# Altium project DigitalLabBoard.PrjPCB
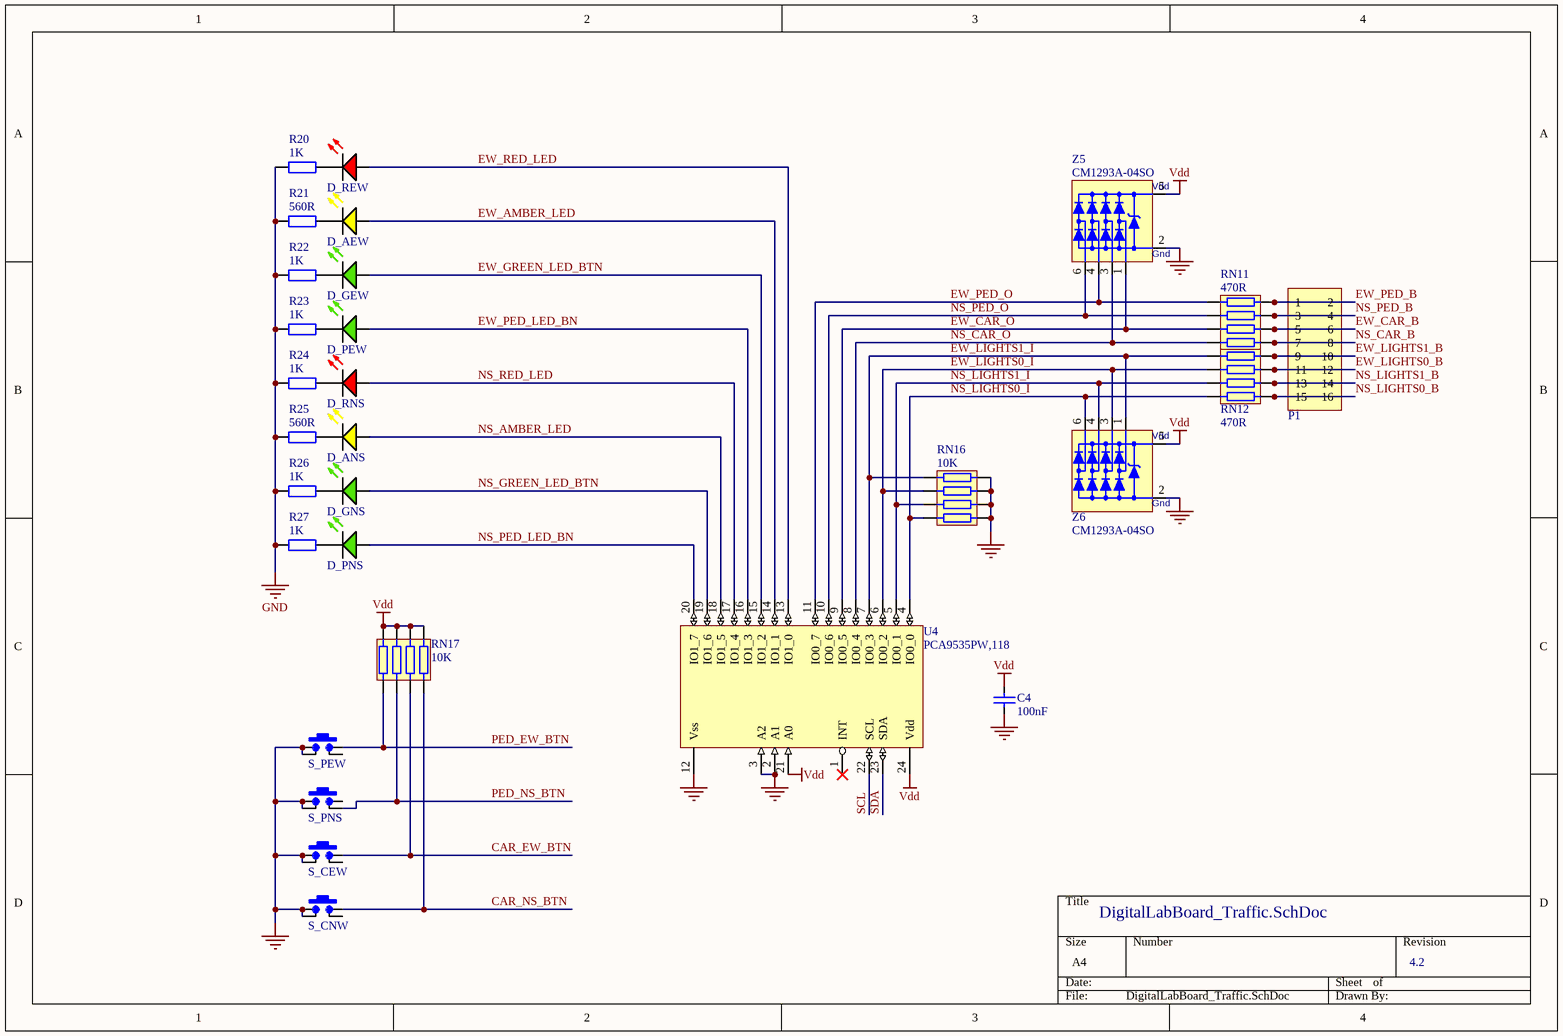
[diagram p0: DigitalLabBoard_Traffic.SchDoc]
Version: 4.2
6 sheets, 189 parts. Net scope: global (net labels, ports and power ports of the same name join across sheets).
Board files: DigitalLabBoard.PcbDoc, DigitalLabBoard_Jig.PcbDoc
Sheets:
  DigitalLabBoard_Traffic.SchDoc
  DigitalLabBoard_Processor.SchDoc
  DigitalLabBoard_Switches.SchDoc
  DigitalLabBoard_LEDs.SchDoc
  DigitalLabBoard_Die.SchDoc
  DigitalLabBoard_Stepper.SchDoc

## Sheet DigitalLabBoard_Traffic.SchDoc
size A4

### Parts
C4  100nF  [CCNP1608-0603]
D_AEW  LED Yellow  [LED1608-0603-Yellow]  (value not drawn)
D_ANS  LED Yellow  [LED1608-0603-Yellow]  (value not drawn)
D_GEW  LED Green  [LED1608-0603-GREEN]  (value not drawn)
D_GNS  LED Green  [LED1608-0603-GREEN]  (value not drawn)
D_PEW  LED Green  [LED1608-0603-GREEN]  (value not drawn)
D_PNS  LED Green  [LED1608-0603-GREEN]  (value not drawn)
D_REW  LED Red  [LED1608-0603-RED]  (value not drawn)
D_RNS  LED Red  [LED1608-0603-RED]  (value not drawn)
P1  Header 2x8  [HDR2X8S]  (value not drawn)
R20  1K  [CR1608-0603]
R21  560R  [CR1608-0603]
R22  1K  [CR1608-0603]
R23  1K  [CR1608-0603]
R24  1K  [CR1608-0603]
R25  560R  [CR1608-0603]
R26  1K  [CR1608-0603]
R27  1K  [CR1608-0603]
RN11  470R  [CR1206-0603_X4_N]
RN12  470R  [CR1206-0603_X4_N]
RN16  10K  [CR1206-0603_X4_N]
RN17  10K  [CR1206-0603_X4_N]
S_CEW  SMD-SW-4_5.1x5.1x2.0_M  [SMD-SW-4_5.1x5.1x2.0_M]  (value not drawn)
S_CNW  SMD-SW-4_5.1x5.1x2.0_M  [SMD-SW-4_5.1x5.1x2.0_M]  (value not drawn)
S_PEW  SMD-SW-4_5.1x5.1x2.0_M  [SMD-SW-4_5.1x5.1x2.0_M]  (value not drawn)
S_PNS  SMD-SW-4_5.1x5.1x2.0_M  [SMD-SW-4_5.1x5.1x2.0_M]  (value not drawn)
U4  PCA9535PW,118  [TSSOP24_N]
Z5  CM1293A-04SO  [SOT457_N]
Z6  CM1293A-04SO  [SOT457_N]

### Nets
GND: C4.1 R20.1 R21.1 R22.1 R23.1 R24.1 R25.1 R26.1 R27.1 RN16.5 RN16.6 RN16.7 RN16.8 S_CEW.1 S_CEW.1b S_CNW.1 S_CNW.1b S_PEW.2 S_PEW.2b S_PNS.1 S_PNS.1b U4.2(A1) U4.3(A2) U4.12(Vss) Z5.2(Vn) Z6.2(Vn)
Vdd: C4.2 RN17.1 RN17.2 RN17.3 RN17.4 U4.21(A0) U4.24(Vdd) Z5.5(Vp) Z6.5(Vp)  [project net Vcc]
CAR_EW_BTN: RN17.6 S_CEW.2b
CAR_NS_BTN: RN17.5 S_CNW.2b
EW_AMBER_LED: D_AEW.A U4.14(IO1_1)
EW_CAR_B: P1.5 P1.6 RN11.7
EW_CAR_O: RN11.2 U4.9(IO0_5) Z5.1
EW_GREEN_LED_BTN: D_GEW.A U4.15(IO1_2)
EW_LIGHTS0_B: P1.11 P1.12 RN12.6
EW_LIGHTS0_I: RN12.3 RN16.3 U4.6(IO0_2) Z6.3
EW_LIGHTS1_B: P1.9 P1.10 RN12.5
EW_LIGHTS1_I: RN12.4 RN16.4 U4.7(IO0_3) Z6.1
EW_PED_B: P1.1 P1.2 RN11.5
EW_PED_LED_BN: D_PEW.A U4.16(IO1_3)
EW_PED_O: RN11.4 U4.11(IO0_7) Z5.4
EW_RED_LED: D_REW.A U4.13(IO1_0)
NS_AMBER_LED: D_ANS.A U4.18(IO1_5)
NS_CAR_B: P1.7 P1.8 RN11.8
NS_CAR_O: RN11.1 U4.8(IO0_4) Z5.3
NS_GREEN_LED_BTN: D_GNS.A U4.19(IO1_6)
NS_LIGHTS0_B: P1.15 P1.16 RN12.8
NS_LIGHTS0_I: RN12.1 RN16.1 U4.4(IO0_0) Z6.6
NS_LIGHTS1_B: P1.13 P1.14 RN12.7
NS_LIGHTS1_I: RN12.2 RN16.2 U4.5(IO0_1) Z6.4
NS_PED_B: P1.3 P1.4 RN11.6
NS_PED_LED_BN: D_PNS.A U4.20(IO1_7)
NS_PED_O: RN11.3 U4.10(IO0_6) Z5.6
NS_RED_LED: D_RNS.A U4.17(IO1_4)
PED_EW_BTN: RN17.8 S_PEW.1b
PED_NS_BTN: RN17.7 S_PNS.2
SCL: U4.22(SCL)
SDA: U4.23(SDA)
NetD_AEW_K: D_AEW.K R21.2
NetD_ANS_K: D_ANS.K R25.2
NetD_GEW_K: D_GEW.K R22.2
NetD_GNS_K: D_GNS.K R26.2
NetD_PEW_K: D_PEW.K R23.2
NetD_PNS_K: D_PNS.K R27.2
NetD_REW_K: D_REW.K R20.2
NetD_RNS_K: D_RNS.K R24.2

Not connected (* = marked no-connect by the designer): S_CEW 2; S_CNW 2; S_PEW 1; S_PNS 2b; U4 1(INT)*

### Notes on the sheet
- (in symbol CM1293A-04SO) Vdd; Gnd

### Library data of the parts
C4 = Cap_CCNP_0603: Capacitor non-polar SMT 0603; Manufacturer: Generic Components; Class: Passive; Published: 08/06/2000; Publisher: Altium Hobart Technology Centre; SubClass: Capacitor; Farnell PN: *; Digikey: *; Value: 100nF; LCSC: C14663
D_AEW D_ANS = LED-0603-Yellow: LED 0603 Yellow; Manufacturer: Generic Components; Class I: Optoelectronic; Published: 8-Jun-2000; Revision: July-2002: Re-released for DXP Platform.; Publisher: Altium Limited; Class II: LED; Farnell PN: 5790852; Digikey: *; LCSC: C72038
D_GEW D_GNS D_PEW D_PNS = LED-0603-Green: LED 0603 Green; Manufacturer: Generic Components; Class I: Optoelectronic; Published: 8-Jun-2000; Revision: July-2002: Re-released for DXP Platform.; Publisher: Altium Limited; Class II: LED; Farnell PN: 1581242; Digikey: *; LCSC: C72043
D_REW D_RNS = LED-0603-Red: LED 0603 Red; Manufacturer: Generic Components; Class I: Optoelectronic; Published: 8-Jun-2000; Revision: July-2002: Re-released for DXP Platform.; Publisher: Altium Limited; Class II: LED; Farnell PN: 1581239; Digikey: *; LCSC: C2286
R20-R27 = Res_CR0603: Resistor SMT 0603; Manufacturer: Generic Components; Class: Passive; Published: 08/06/2000; Publisher: Altium Hobart Technology Centre; SubClass: Resistor; Farnell PN: *; Digikey: *
  R20 R22-R24 R26 R27: Value: 1K; LCSC: C21190
  R21 R25: Value: 560R; LCSC: C23204
RN11 RN12 = ResistorNetwork_CR0603x4: SMT x4 Resistor Array; Value: 470 ohm; Farnell PN: *; Digikey: *; LCSC: C25510
RN16 RN17 = ResistorNetwork_CR0603x4: SMT x4 Resistor Array; Farnell PN: *; Digikey: *; Value: 10K; LCSC: C29718
S_CEW S_CNW S_PEW S_PNS = SW_PB-TS: Tactile Switch SPST 5.10mm X 5.10mm / (1.5mm=C318884) / (2.0mm=C318888) / (3.5mm=C318886); Revision: 1.0; LCSC: C318888
U4 = PCA9535PW,118: 16-bit I2C I/O Expander (TSSOP24) / NO PUPs on I/O pins; Farnell PN: 2776149; Digikey: 568-10296-1-ND; LCSC: C255606
Z5 Z6 = CM1293A-04SO: Ultra low capacitance quadruple rail-to-rail ESD protection; Farnell PN: 2533258; Digikey: CM1293A-04SOOSCT-ND; LCSC: C393377
P1 = Header 2x8: Digikey: 609-5704-ND

## Sheet DigitalLabBoard_Processor.SchDoc
size A4
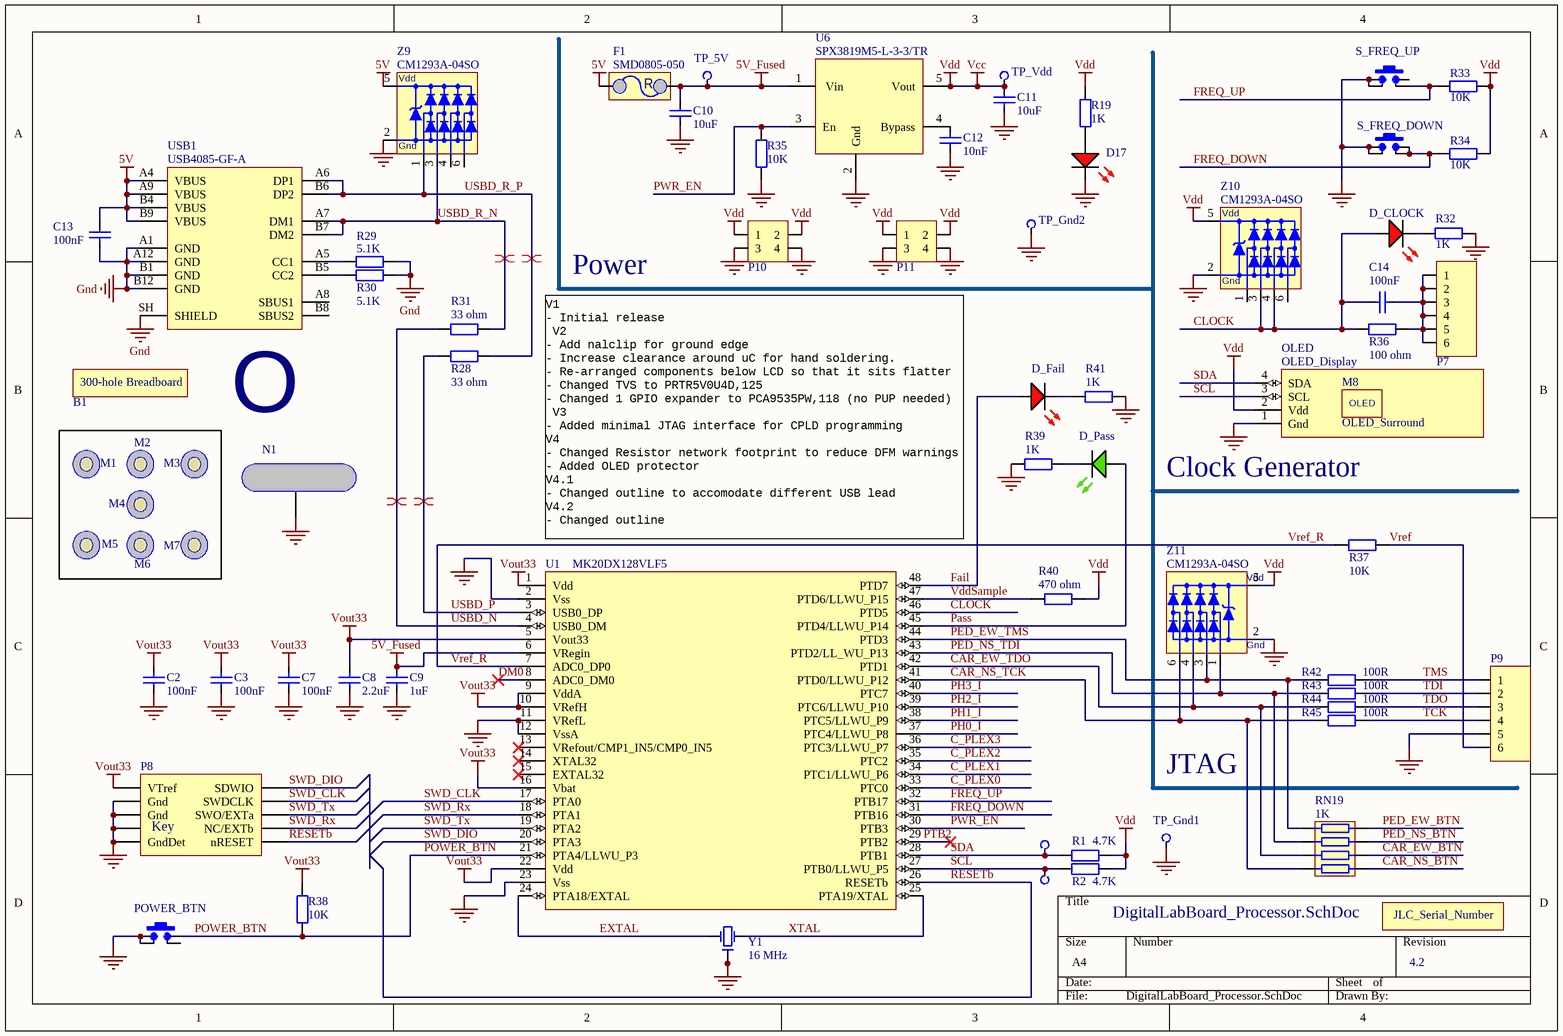
[diagram p1: DigitalLabBoard_Processor.SchDoc]

### Parts
B1  Breadboard - 300 Hole  [Breadboard - 300 holes]  (value not drawn)
C2  100nF  [CCNP1608-0603]
C3  100nF  [CCNP1608-0603]
C7  100nF  [CCNP1608-0603]
C8  2.2uF  [CCNP1608-0603]
C9  1uF  [CCNP1608-0603]
C10  10uF  [CCNP2012-0805]
C11  10uF  [CCNP2012-0805]
C12  10nF  [CCNP1608-0603]
C13  100nF  [CCNP1608-0603]
C14  100nF  [CCNP1608-0603]
D17  LED Red  [LED1608-0603-RED]  (value not drawn)
D_CLOCK  LED Red  [LED1608-0603-RED]  (value not drawn)
D_Fail  LED Red  [LED1608-0603-RED]  (value not drawn)
D_Pass  LED Green  [LED1608-0603-GREEN]  (value not drawn)
F1  SMD0805-050  [SMD0805-050]
JLC_Serial_Number  JLC_Serial_Number  [JLC_Serial_Number]  (value not drawn)  (no BOM)
Logo  OSHW Logo  [OSHW]  (value not drawn)  (no BOM)
M1  Plastic Bumper  [Bumper_RBS-2]  (value not drawn)
M2  Plastic Bumper  [Bumper_RBS-2]  (value not drawn)
M3  Plastic Bumper  [Bumper_RBS-2]  (value not drawn)
M4  Plastic Bumper  [Bumper_RBS-2]  (value not drawn)
M5  Plastic Bumper  [Bumper_RBS-2]  (value not drawn)
M6  Plastic Bumper  [Bumper_RBS-2]  (value not drawn)
M7  Plastic Bumper  [Bumper_RBS-2]  (value not drawn)
M8  OLED_Surround  [OLED_Surround]
N1  Gnd  [Nalclip-Edge]  (value not drawn)  (no BOM)
OLED  OLED_Display  [OLED_Display_128x32]
P7  Header 2x3  [HDR2X3S]  (value not drawn)
P8  SWD Connector 2x5-Pin  [SWD-2x5-Jig-Pads]  (value not drawn)  (no BOM)
P9  Header, 6-Pin  [HDR1X6S]  (value not drawn)
P10  Header 2x2  [HDR2X2S]  (value not drawn)
P11  Header 2x2  [HDR2X2S]  (value not drawn)
POWER_BTN  SMD-SW-4_5.1x5.1x2.0_M  [SMD-SW-4_5.1x5.1x2.0_M]  (value not drawn)
R1  4.7K  [CR1608-0603]
R2  4.7K  [CR1608-0603]
R19  1K  [CR1608-0603]
R28  value 33 ohm  [CR1608-0603]  (hidden comment: 33R)
R29  5.1K  [CR1608-0603]
R30  5.1K  [CR1608-0603]
R31  value 33 ohm  [CR1608-0603]  (hidden comment: 33R)
R32  1K  [CR1608-0603]
R33  10K  [CR1608-0603]
R34  10K  [CR1608-0603]
R35  10K  [CR1608-0603]
R36  value 100 ohm  [CR1608-0603]  (hidden comment: 100R)
R37  10K  [CR1608-0603]
R38  10K  [CR1608-0603]
R39  1K  [CR1608-0603]
R40  value 470 ohm  [CR1608-0603]  (hidden comment: 470R)
R41  1K  [CR1608-0603]
R42  100R  [CR1608-0603]
R43  100R  [CR1608-0603]
R44  100R  [CR1608-0603]
R45  100R  [CR1608-0603]
RN19  1K  [CR1206-0603_X4_N]
S_FREQ_DOWN  SMD-SW-4_5.1x5.1x3.5_M  [SMD-SW-4_5.1x5.1x3.5_M]  (value not drawn)
S_FREQ_UP  SMD-SW-4_5.1x5.1x3.5_M  [SMD-SW-4_5.1x5.1x3.5_M]  (value not drawn)
TP_5V  5V  [PCBPIN - 0.9mm]  (value not drawn)  (no BOM)
TP_Gnd1  Gnd  [PCBPIN - 0.9mm]  (value not drawn)  (no BOM)
TP_Gnd2  Gnd  [PCBPIN - 0.9mm]  (value not drawn)  (no BOM)
TP_SCL  SCL  [PCBPIN - 0.9mm]  (value not drawn)  (no BOM)
TP_SDA  SDA  [PCBPIN - 0.9mm]  (value not drawn)  (no BOM)
TP_Vdd  Vdd  [PCBPIN - 0.9mm]  (value not drawn)  (no BOM)
U1  MK20DX128VLF5  [TSQFP50P900X900-48M]
U6  SPX3819M5-L-3-3/TR  [SOT-23-5_L]
USB1  USB4085-GF-A  [USB4085-GF-A]
Y1  16 MHz  [Crystal_SMD_3.2x2.5]
Z9  CM1293A-04SO  [SOT457_N]
Z10  CM1293A-04SO  [SOT457_N]
Z11  CM1293A-04SO  [SOT457_N]

### Nets
5V: C13.2 F1.1 USB1.A4(VBUS) USB1.A9(VBUS) USB1.B4(VBUS) USB1.B9(VBUS) Z9.5(Vp)
5V_Fused: C9.2 C10.2 F1.2 TP_5V.1(TP) U1.6(VRegin) U6.1(Vin)
GND: C2.1 C3.1 C7.1 C8.1 C9.1 C10.1 C11.1 C12.1 C13.1 D17.K N1.1 OLED.1(Gnd) P8.0(Pins) P8.3(Gnd) P8.5(Gnd) P8.9(GndDet) P9.5 P10.3 P10.4 P11.3 P11.4 POWER_BTN.2 POWER_BTN.2b R29.2 R30.2 R32.2 R35.1 R39.1 R41.1 S_FREQ_DOWN.1 S_FREQ_DOWN.1b S_FREQ_UP.1 S_FREQ_UP.1b TP_Gnd1.1(TP) TP_Gnd2.1(TP) U1.2(Vss) U1.11(VRefL) U1.12(VssA) U1.23(Vss) U6.2(Gnd) USB1.A1(GND) USB1.A12(GND) USB1.B1(GND) USB1.B12(GND) USB1.SH(SHIELD) Y1.2(Gnd) Y1.4(Gnd) Z9.2(Vn) Z10.2(Vn) Z11.2(Vn)
Vcc: C11.2 OLED.2(Vdd) P10.1 P10.2 P11.1 P11.2 R1.2 R2.2 R19.2 R33.2 R34.2 R40.1 TP_Vdd.1(TP) U6.5(Vout) Z10.5(Vp) Z11.5(Vp)  [also labelled Vdd]
Vout33: C2.2 C3.2 C7.2 C8.2 P8.1(VTref) R38.1 U1.1(Vdd) U1.5(Vout33) U1.9(VddA) U1.10(VRefH) U1.16(Vbat) U1.22(Vdd)
C_PLEX0: U1.33(PTC0)
C_PLEX1: U1.34(PTC1/LLWU_P6)
C_PLEX2: U1.35(PTC2)
C_PLEX3: U1.36(PTC3/LLWU_P7)
CAR_EW_BTN: RN19.6
CAR_EW_TDO: R44.1 RN19.3 U1.42(PTD1) Z11.4
CAR_NS_BTN: RN19.5
CAR_NS_TCK: R45.1 RN19.4 U1.41(PTD0/LLWU_P12) Z11.6
CLOCK: C14.2 D_CLOCK.A R36.2 U1.46(PTD5) Z10.3 Z10.4
DM0: U1.8(ADC0_DM0)
EXTAL: U1.24(PTA18/EXTAL) Y1.3(OSC2)
Fail: D_Fail.A U1.48(PTD7)
FREQ_DOWN: R34.1 S_FREQ_DOWN.2 S_FREQ_DOWN.2b U1.31(PTB16)
FREQ_UP: R33.1 S_FREQ_UP.2 U1.32(PTB17)
Pass: D_Pass.A U1.45(PTD4/LLWU_P14)
PED_EW_BTN: RN19.8
PED_EW_TMS: R42.1 RN19.1 U1.44(PTD3) Z11.3
PED_NS_BTN: RN19.7
PED_NS_TDI: R43.1 RN19.2 U1.43(PTD2/LL_WU_P13) Z11.1
PH0_I: U1.37(PTC4/LLWU_P8)
PH1_I: U1.38(PTC5/LLWU_P9)
PH2_I: U1.39(PTC6/LLWU_P10)
PH3_I: U1.40(PTC7)
POWER_BTN: POWER_BTN.1b R38.2 U1.21(PTA4/LLWU_P3)
PTB2: U1.29(PTB2)
PWR_EN: R35.2 U1.30(PTB3) U6.3(En)
RESETb: P8.10(nRESET) U1.26(RESETb)
SCL: OLED.3(SCL) R2.1 TP_SCL.1(TP) U1.27(PTB0/LLWU_P5)
SDA: OLED.4(SDA) R1.1 TP_SDA.1(TP) U1.28(PTB1)
SWD_CLK: P8.4(SWDCLK) U1.17(PTA0)
SWD_DIO: P8.2(SDWIO) U1.20(PTA3)
SWD_Rx: P8.8(NC/EXTb) U1.18(PTA1)
SWD_Tx: P8.6(SWO/EXTa) U1.19(PTA2)
TCK: P9.4 R45.2
TDI: P9.2 R43.2
TDO: P9.3 R44.2
TMS: P9.1 R42.2
USBD_N: R31.2 U1.4(USB0_DM)
USBD_P: R28.2 U1.3(USB0_DP)
USBD_R_N: R31.1 USB1.A7(DM1) USB1.B7(DM2) Z9.3
USBD_R_P: R28.1 USB1.A6(DP1) USB1.B6(DP2) Z9.1
VddSample: R40.2 U1.47(PTD6/LLWU_P15)
Vref: P9.6 R37.2
Vref_R: R37.1 U1.7(ADC0_DP0)
XTAL: U1.25(PTA19/XTAL) Y1.1(OSC1)
NetC12_2: C12.2 U6.4(Bypass)
NetC14_1: C14.1 P7.1 P7.2 P7.3 P7.4 P7.5 P7.6 R36.1
NetD17_A: D17.A R19.1
NetD_CLOCK_K: D_CLOCK.K R32.1
NetD_Fail_K: D_Fail.K R41.2
NetD_Pass_K: D_Pass.K R39.2
NetR29_1: R29.1 USB1.A5(CC1)
NetR30_1: R30.1 USB1.B5(CC2)

Not connected (* = marked no-connect by the designer): POWER_BTN 1; S_FREQ_UP 2b; U1 13(VRefout/CMP1_IN5/CMP0_IN5)* 14(XTAL32)* 15(EXTAL32)*; USB1 A8(SBUS1) B8(SBUS2); Z9 4 6; Z10 1 6

### Layout directives
differential pair: USBD_N, USBD_P, USBD_R_N, USBD_R_P

### Notes on the sheet
- Power
- (near OLED) Clock Generator
- V1
  - Initial release
  V2
  - Add nalclip for ground edge
  - Increase clearance around uC for hand soldering.
  - Re-arranged components below LCD so that it sits flatter
  - Changed TVS to PRTR5V0U4D,125
  - Changed 1 GPIO expander to PCA9535PW,118 (no PUP needed)
  V3
  - Added minimal JTAG interface for CPLD programming
  V4
  - Changed Resistor network footprint to reduce DFM warnings
  - Added OLED protector
  V4.1
  - Changed outline to accomodate different USB lead
  V4.2
  - Changed outline
- JTAG
- (in symbol Breadboard - 300 holes) 300-hole Breadboard
- (in symbol CM1293A-04SO) Vdd; Gnd
- (in symbol OLED_Surround) OLED
- (in symbol OSHW Logo) O
- (in symbol SMD0805-050) R
- (in symbol SWD2X5_JIG) Key

### Library data of the parts
B1 = Breadboard - 300 holes
C2 C3 C7 C13 C14 = Cap_CCNP_0603: as C4 on sheet DigitalLabBoard_Traffic; Published: 08/06/2000; Publisher: Altium Hobart Technology Centre; SubClass: Capacitor; Farnell PN: *; Digikey: *; Value: 100nF; LCSC: C14663
C8-C12 = Cap: Capacitor; Manufacturer: Generic Components; Class: Passive; Published: 08/06/2000; Publisher: Altium Hobart Technology Centre; SubClass: Capacitor; Farnell PN: *; Digikey: *
  C8: Value: 2.2uF; LCSC: C23630
  C9: Value: 1uF; LCSC: C15849
  C10 C11: Value: 10uF; LCSC: C15850
  C12: Value: 10nF; LCSC: C57112
D17 D_CLOCK D_Fail = LED-0603-Red: as D_REW on sheet DigitalLabBoard_Traffic; Published: 8-Jun-2000; Revision: July-2002: Re-released for DXP Platform.; Publisher: Altium Limited; Class II: LED; Farnell PN: 1581239; Digikey: *; LCSC: C2286
D_Pass = LED-0603-Green: as D_GEW on sheet DigitalLabBoard_Traffic; Published: 8-Jun-2000; Revision: July-2002: Re-released for DXP Platform.; Publisher: Altium Limited; Class II: LED; Farnell PN: 1581242; Digikey: *; LCSC: C72043
F1 = SMD0805-050: PTC Resetable Fuse 0805 0.5A hold; LCSC: C66452
M1-M7 = Mounting_Feet: Plastic bumper/foot; Digikey: RPC4821-ND; Farnell PN: 1800864; LCSC: *
N1 = Nalclip-Edge
OLED = OLED_Display: OLED Display 128x32 pixels, I2C interface; LCSC: *
P8 = SWD2X5_JIG: LatestRevisionDate: 17-Jul-2002; LatestRevisionNote: Re-released for DXP Platform.; Publisher: Altium Limited; Farnell PN: 1865285; LCSC: *
P9 = Header 1x6: LatestRevisionDate: 17-Jul-2002; LatestRevisionNote: Re-released for DXP Platform.; Publisher: Altium Limited; LCSC: *; Farnell PN: 1835481; Digikey: 609-3272-ND
POWER_BTN S_FREQ_DOWN S_FREQ_UP = SW_PB-TS: as S_CEW on sheet DigitalLabBoard_Traffic; Revision: 1.0
  POWER_BTN: LCSC: C318888
  S_FREQ_DOWN S_FREQ_UP: LCSC: C318886
R1 R2 R19 R28-R45 = Res_CR0603: as R20 on sheet DigitalLabBoard_Traffic; Published: 08/06/2000; Publisher: Altium Hobart Technology Centre; SubClass: Resistor; Farnell PN: *; Digikey: *
  R1 R2: Value: 4.7K; LCSC: C23162
  R19 R32 R39 R41: Value: 1K; LCSC: C21190
  R28 R31: LCSC: C23140
  R29 R30: Value: 5.1K; LCSC: C23186
  R33-R35 R37 R38: Value: 10K; LCSC: C25804
  R36: LCSC: C22775
  R40: LCSC: C23179
  R42-R45: LCSC: C22775; Value: 100R
RN19 = ResistorNetwork_CR0603x4: SMT x4 Resistor Array; Farnell PN: *; Digikey: *; Value: 1K; LCSC: C20197
TP_5V TP_Gnd1 TP_Gnd2 TP_SCL TP_SDA TP_Vdd = TP: Test Point; Digikey: *; Farnell PN: *
U1 = MK20DX128VLF5: Kinetis K20: 50MHz Cortex-M4 Performance MCU, 160KB Flash, 16KB SRAM, Full-Speed USB, 48-LQFP; Farnell PN: 2133571; Digikey: MK20DX128VLF50-ND; Mouser: 841-MK20DX128VLF5
U6 = SPX3819M5-L-3-3/TR: 3.3V LDO with enable; LCSC: C9055; Farnell PN: 2889625; Digikey: 1016-1873-1-ND
USB1 = USB4085-GF-A: USB-C, USB 2.0 Receptacle Connector 16 Position Through Hole, Right Angle; Angle: 90; Part Number: USB4085-GF-A; Digikey Part Number: 2073-USB4085-GF-ACT-ND; Digikey Link: https://www.digikey.ee/product-detail/en/gct/USB4085-GF-A/2073-USB4085-GF-ACT-ND/9859733; Farnell PN: 2924867; Digikey: 2073-USB4085-GF-ACT-ND; LCSC: *
Y1 = Crystal 16MHz: Crystal SMD 3.2 x 2.5 x 0.7 mm; Manufacturer: Generic Components; Class: Oscillator; SubClass: Crystal Oscillator; Published: 08/06/2000; Publisher: Altium Hobart Technology Centre; Digikey: *; Farnell PN: *; LCSC: C13738
Z9-Z11 = CM1293A-04SO: as Z5 on sheet DigitalLabBoard_Traffic; Farnell PN: 2533258; Digikey: CM1293A-04SOOSCT-ND; LCSC: C393377
M8 = OLED_Surround: Digikey: RPC4821-ND; Farnell PN: 1800864
P7 = Header 2x3: LCSC: *; Farnell PN: 2886106; Digikey: 609-5700-ND
P10 P11 = Header 2x2: LCSC: *; Farnell PN: 1622403; Digikey: 609-5699-ND

## Sheet DigitalLabBoard_Switches.SchDoc
size A4
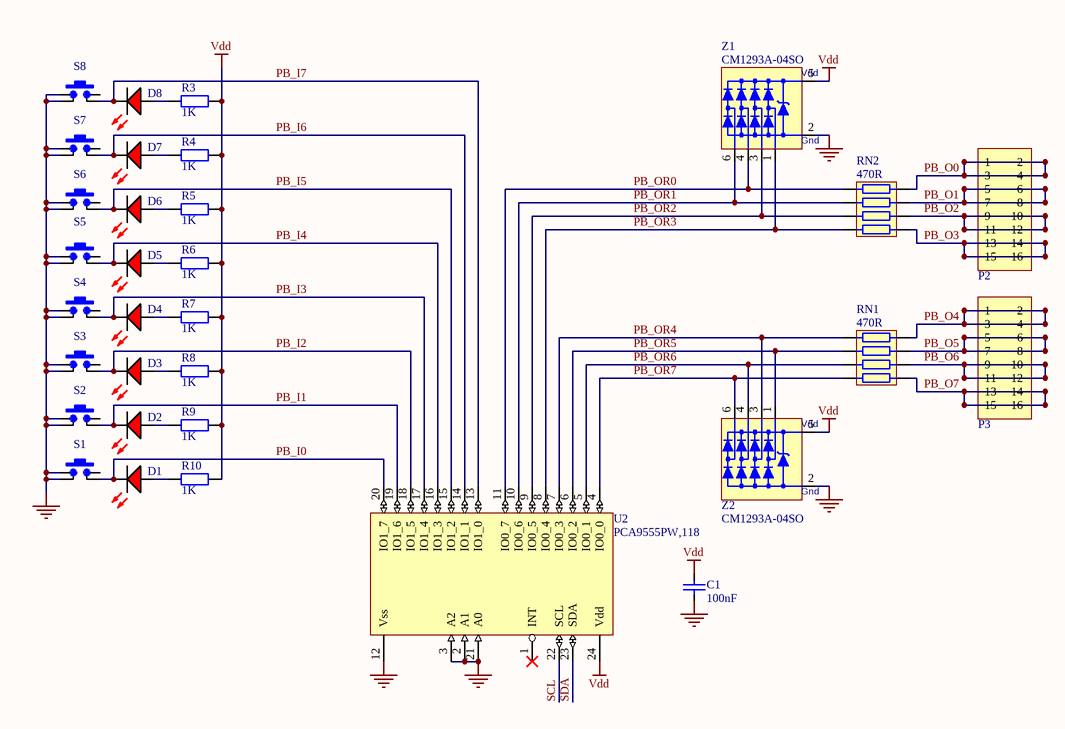
[diagram p2: DigitalLabBoard_Switches.SchDoc]

### Parts
C1  100nF  [CCNP1608-0603]
D1  LED Red  [LED1608-0603-RED]  (value not drawn)
D2  LED Red  [LED1608-0603-RED]  (value not drawn)
D3  LED Red  [LED1608-0603-RED]  (value not drawn)
D4  LED Red  [LED1608-0603-RED]  (value not drawn)
D5  LED Red  [LED1608-0603-RED]  (value not drawn)
D6  LED Red  [LED1608-0603-RED]  (value not drawn)
D7  LED Red  [LED1608-0603-RED]  (value not drawn)
D8  LED Red  [LED1608-0603-RED]  (value not drawn)
P2  Header 2x8  [HDR2X8S]  (value not drawn)
P3  Header 2x8  [HDR2X8S]  (value not drawn)
R3  1K  [CR1608-0603]
R4  1K  [CR1608-0603]
R5  1K  [CR1608-0603]
R6  1K  [CR1608-0603]
R7  1K  [CR1608-0603]
R8  1K  [CR1608-0603]
R9  1K  [CR1608-0603]
R10  1K  [CR1608-0603]
RN1  470R  [CR1206-0603_X4_N]
RN2  470R  [CR1206-0603_X4_N]
S1  SMD-SW-4_5.1x5.1x2.0_M  [SMD-SW-4_5.1x5.1x2.0_M]  (value not drawn)
S2  SMD-SW-4_5.1x5.1x2.0_M  [SMD-SW-4_5.1x5.1x2.0_M]  (value not drawn)
S3  SMD-SW-4_5.1x5.1x2.0_M  [SMD-SW-4_5.1x5.1x2.0_M]  (value not drawn)
S4  SMD-SW-4_5.1x5.1x2.0_M  [SMD-SW-4_5.1x5.1x2.0_M]  (value not drawn)
S5  SMD-SW-4_5.1x5.1x2.0_M  [SMD-SW-4_5.1x5.1x2.0_M]  (value not drawn)
S6  SMD-SW-4_5.1x5.1x2.0_M  [SMD-SW-4_5.1x5.1x2.0_M]  (value not drawn)
S7  SMD-SW-4_5.1x5.1x2.0_M  [SMD-SW-4_5.1x5.1x2.0_M]  (value not drawn)
S8  SMD-SW-4_5.1x5.1x2.0_M  [SMD-SW-4_5.1x5.1x2.0_M]  (value not drawn)
U2  PCA9555PW,118  [TSSOP24_N]
Z1  CM1293A-04SO  [SOT457_N]
Z2  CM1293A-04SO  [SOT457_N]

### Nets
GND: C1.1 S1.1 S1.1b S2.1 S2.1b S3.1 S3.1b S4.1 S4.1b S5.1 S5.1b S6.1 S6.1b S7.1 S7.1b S8.1 S8.1b U2.2(A1) U2.3(A2) U2.12(Vss) U2.21(A0) Z1.2(Vn) Z2.2(Vn)
Vdd: C1.2 R3.2 R4.2 R5.2 R6.2 R7.2 R8.2 R9.2 R10.2 U2.24(Vdd) Z1.5(Vp) Z2.5(Vp)  [project net Vcc]
PB_I0: D1.K S1.2 U2.20(IO1_7)
PB_I1: D2.K S2.2 U2.19(IO1_6)
PB_I2: D3.K S3.2 U2.18(IO1_5)
PB_I3: D4.K S4.2 U2.17(IO1_4)
PB_I4: D5.K S5.2 U2.16(IO1_3)
PB_I5: D6.K S6.2 U2.15(IO1_2)
PB_I6: D7.K S7.2 U2.14(IO1_1)
PB_I7: D8.K S8.2 U2.13(IO1_0)
PB_O0: P2.1 P2.2 P2.3 P2.4 RN2.4
PB_O1: P2.5 P2.6 P2.7 P2.8 RN2.3
PB_O2: P2.9 P2.10 P2.11 P2.12 RN2.2
PB_O3: P2.13 P2.14 P2.15 P2.16 RN2.1
PB_O4: P3.1 P3.2 P3.3 P3.4 RN1.4
PB_O5: P3.5 P3.6 P3.7 P3.8 RN1.3
PB_O6: P3.9 P3.10 P3.11 P3.12 RN1.2
PB_O7: P3.13 P3.14 P3.15 P3.16 RN1.1
PB_OR0: RN2.5 U2.11(IO0_7) Z1.4
PB_OR1: RN2.6 U2.10(IO0_6) Z1.6
PB_OR2: RN2.7 U2.9(IO0_5) Z1.3
PB_OR3: RN2.8 U2.8(IO0_4) Z1.1
PB_OR4: RN1.5 U2.7(IO0_3) Z2.3
PB_OR5: RN1.6 U2.6(IO0_2) Z2.1
PB_OR6: RN1.7 U2.5(IO0_1) Z2.4
PB_OR7: RN1.8 U2.4(IO0_0) Z2.6
SCL: U2.22(SCL)
SDA: U2.23(SDA)
NetD1_A: D1.A R10.1
NetD2_A: D2.A R9.1
NetD3_A: D3.A R8.1
NetD4_A: D4.A R7.1
NetD5_A: D5.A R6.1
NetD6_A: D6.A R5.1
NetD7_A: D7.A R4.1
NetD8_A: D8.A R3.1

Not connected (* = marked no-connect by the designer): S1 2b; S2 2b; S3 2b; S4 2b; S5 2b; S6 2b; S7 2b; S8 2b; U2 1(INT)*

### Notes on the sheet
- (in symbol CM1293A-04SO) Vdd; Gnd

### Library data of the parts
C1 = Cap_CCNP_0603: as C4 on sheet DigitalLabBoard_Traffic; Published: 08/06/2000; Publisher: Altium Hobart Technology Centre; SubClass: Capacitor; Farnell PN: *; Digikey: *; Value: 100nF; LCSC: C14663
D1-D8 = LED-0603-Red: as D_REW on sheet DigitalLabBoard_Traffic; Published: 8-Jun-2000; Revision: July-2002: Re-released for DXP Platform.; Publisher: Altium Limited; Class II: LED; Farnell PN: 1581239; Digikey: *; LCSC: C2286
R3-R10 = Res_CR0603: as R20 on sheet DigitalLabBoard_Traffic; Published: 08/06/2000; Publisher: Altium Hobart Technology Centre; SubClass: Resistor; Farnell PN: *; Digikey: *; Value: 1K; LCSC: C21190
RN1 RN2 = ResistorNetwork_CR0603x4: SMT x4 Resistor Array; Value: 470 ohm; Farnell PN: *; Digikey: *; LCSC: C25510
S1-S8 = SW_PB-TS: as S_CEW on sheet DigitalLabBoard_Traffic; Revision: 1.0; LCSC: C318888
U2 = PCA9555PW,118: 16-bit I2C I/O Expander (TSSOP24) / PUPs on I/O pins; Farnell PN: 2101299; Digikey: 568-1058-1-ND; LCSC: C128392
Z1 Z2 = CM1293A-04SO: as Z5 on sheet DigitalLabBoard_Traffic; Farnell PN: 2533258; Digikey: CM1293A-04SOOSCT-ND; LCSC: C393377
P2 P3 = Header 2x8: Digikey: 609-5704-ND; Parameter 2: *

## Sheet DigitalLabBoard_LEDs.SchDoc
size A4
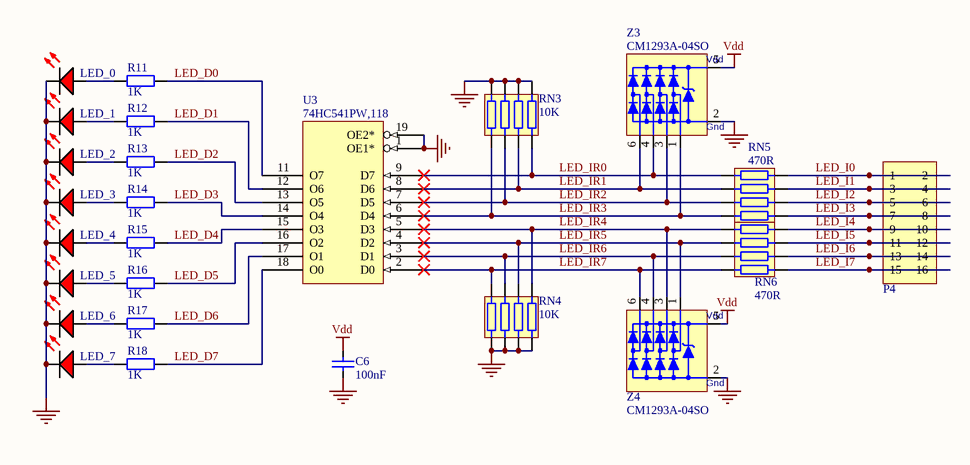
[diagram p3: DigitalLabBoard_LEDs.SchDoc]

### Parts
C6  100nF  [CCNP1608-0603]
LED_0  LED Red  [LED1608-0603-RED]  (value not drawn)
LED_1  LED Red  [LED1608-0603-RED]  (value not drawn)
LED_2  LED Red  [LED1608-0603-RED]  (value not drawn)
LED_3  LED Red  [LED1608-0603-RED]  (value not drawn)
LED_4  LED Red  [LED1608-0603-RED]  (value not drawn)
LED_5  LED Red  [LED1608-0603-RED]  (value not drawn)
LED_6  LED Red  [LED1608-0603-RED]  (value not drawn)
LED_7  LED Red  [LED1608-0603-RED]  (value not drawn)
P4  Header 2x8  [HDR2X8S]  (value not drawn)
R11  1K  [CR1608-0603]
R12  1K  [CR1608-0603]
R13  1K  [CR1608-0603]
R14  1K  [CR1608-0603]
R15  1K  [CR1608-0603]
R16  1K  [CR1608-0603]
R17  1K  [CR1608-0603]
R18  1K  [CR1608-0603]
RN3  10K  [CR1206-0603_X4_N]
RN4  10K  [CR1206-0603_X4_N]
RN5  470R  [CR1206-0603_X4_N]
RN6  470R  [CR1206-0603_X4_N]
U3  74HC541PW,118  [TSSOP20_N]
Z3  CM1293A-04SO  [SOT457_N]
Z4  CM1293A-04SO  [SOT457_N]

### Nets
GND: C6.1 LED_0.K LED_1.K LED_2.K LED_3.K LED_4.K LED_5.K LED_6.K LED_7.K RN3.1 RN3.2 RN3.3 RN3.4 RN4.1 RN4.2 RN4.3 RN4.4 U3.1(OE1*) U3.10(Gnd) U3.19(OE2*) Z3.2(Vn) Z4.2(Vn)
Vcc: C6.2 U3.20(Vdd) Z3.5(Vp) Z4.5(Vp)  [also labelled Vdd]
LED_D0: R11.2 U3.11(O7)
LED_D1: R12.2 U3.12(O6)
LED_D2: R13.2 U3.13(O5)
LED_D3: R14.2 U3.14(O4)
LED_D4: R15.2 U3.15(O3)
LED_D5: R16.2 U3.16(O2)
LED_D6: R17.2 U3.17(O1)
LED_D7: R18.2 U3.18(O0)
LED_I0: P4.1 P4.2 RN5.5
LED_I1: P4.3 P4.4 RN5.6
LED_I2: P4.5 P4.6 RN5.7
LED_I3: P4.7 P4.8 RN5.8
LED_I4: P4.9 P4.10 RN6.5
LED_I5: P4.11 P4.12 RN6.6
LED_I6: P4.13 P4.14 RN6.7
LED_I7: P4.15 P4.16 RN6.8
LED_IR0: RN3.5 RN5.4 U3.9(D7) Z3.4
LED_IR1: RN3.6 RN5.3 U3.8(D6) Z3.6
LED_IR2: RN3.7 RN5.2 U3.7(D5) Z3.3
LED_IR3: RN3.8 RN5.1 U3.6(D4) Z3.1
LED_IR4: RN4.5 RN6.4 U3.5(D3) Z4.3
LED_IR5: RN4.6 RN6.3 U3.4(D2) Z4.1
LED_IR6: RN4.7 RN6.2 U3.3(D1) Z4.4
LED_IR7: RN4.8 RN6.1 U3.2(D0) Z4.6
NetLED_0_A: LED_0.A R11.1
NetLED_1_A: LED_1.A R12.1
NetLED_2_A: LED_2.A R13.1
NetLED_3_A: LED_3.A R14.1
NetLED_4_A: LED_4.A R15.1
NetLED_5_A: LED_5.A R16.1
NetLED_6_A: LED_6.A R17.1
NetLED_7_A: LED_7.A R18.1

### Notes on the sheet
- (in symbol CM1293A-04SO) Vdd; Gnd

### Library data of the parts
C6 = Cap_CCNP_0603: as C4 on sheet DigitalLabBoard_Traffic; Published: 08/06/2000; Publisher: Altium Hobart Technology Centre; SubClass: Capacitor; Farnell PN: *; Digikey: *; Value: 100nF; LCSC: C14663
LED_0-LED_7 = LED-0603-Red: as D_REW on sheet DigitalLabBoard_Traffic; Published: 8-Jun-2000; Revision: July-2002: Re-released for DXP Platform.; Publisher: Altium Limited; Class II: LED; Farnell PN: 1581239; Digikey: *; LCSC: C2286
R11-R18 = Res_CR0603: as R20 on sheet DigitalLabBoard_Traffic; Published: 08/06/2000; Publisher: Altium Hobart Technology Centre; SubClass: Resistor; Farnell PN: *; Digikey: *; Value: 1K; LCSC: C21190
RN3 RN4 = ResistorNetwork_CR0603x4: SMT x4 Resistor Array; Farnell PN: *; Digikey: *; Value: 10K; LCSC: C29718
RN5 RN6 = ResistorNetwork_CR0603x4: SMT x4 Resistor Array; Value: 470 ohm; Farnell PN: *; Digikey: *; LCSC: C25510
U3 = 74HC541PW,118: Octal 3-State Buffer/Line Driver/LineReceiver; Digikey: 1727-5960-1-ND; Farnell PN: 2444902; LCSC: C5657
Z3 Z4 = CM1293A-04SO: as Z5 on sheet DigitalLabBoard_Traffic; Farnell PN: 2533258; Digikey: CM1293A-04SOOSCT-ND; LCSC: C393377
P4 = Header 2x8: Digikey: 609-5704-ND; Parameter 2: *

## Sheet DigitalLabBoard_Die.SchDoc
size A4
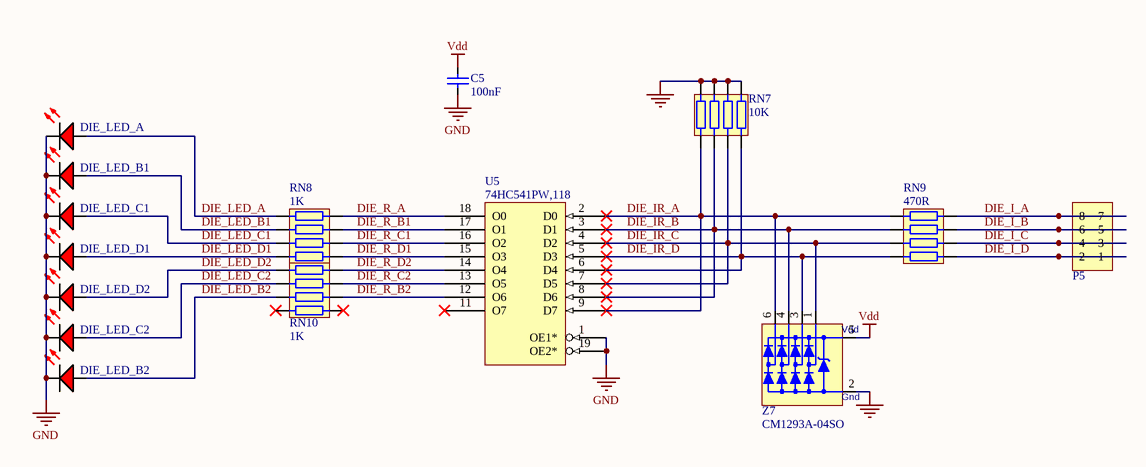
[diagram p4: DigitalLabBoard_Die.SchDoc]

### Parts
C5  100nF  [CCNP1608-0603]
DIE_LED_A  LED Red  [LED1608-0603-RED]  (value not drawn)
DIE_LED_B1  LED Red  [LED1608-0603-RED]  (value not drawn)
DIE_LED_B2  LED Red  [LED1608-0603-RED]  (value not drawn)
DIE_LED_C1  LED Red  [LED1608-0603-RED]  (value not drawn)
DIE_LED_C2  LED Red  [LED1608-0603-RED]  (value not drawn)
DIE_LED_D1  LED Red  [LED1608-0603-RED]  (value not drawn)
DIE_LED_D2  LED Red  [LED1608-0603-RED]  (value not drawn)
P5  Header 2x4  [HDR2X4S]  (value not drawn)
RN7  10K  [CR1206-0603_X4_N]
RN8  1K  [CR1206-0603_X4_N]
RN9  470R  [CR1206-0603_X4_N]
RN10  1K  [CR1206-0603_X4_N]
U5  74HC541PW,118  [TSSOP20_N]
Z7  CM1293A-04SO  [SOT457_N]

### Nets
GND: C5.1 DIE_LED_A.K DIE_LED_B1.K DIE_LED_B2.K DIE_LED_C1.K DIE_LED_C2.K DIE_LED_D1.K DIE_LED_D2.K RN7.1 RN7.2 RN7.3 RN7.4 U5.1(OE1*) U5.10(Gnd) U5.19(OE2*) Z7.2(Vn)
Vcc: C5.2 U5.20(Vdd) Z7.5(Vp)  [also labelled Vdd]
DIE_I_A: P5.7 P5.8 RN9.8
DIE_I_B: P5.5 P5.6 RN9.7
DIE_I_C: P5.3 P5.4 RN9.6
DIE_I_D: P5.1 P5.2 RN9.5
DIE_IR_A: RN7.8 RN9.1 U5.2(D0) U5.9(D7) Z7.6
DIE_IR_B: RN7.7 RN9.2 U5.3(D1) U5.8(D6) Z7.4
DIE_IR_C: RN7.6 RN9.3 U5.4(D2) U5.7(D5) Z7.1
DIE_IR_D: RN7.5 RN9.4 U5.5(D3) U5.6(D4) Z7.3
DIE_LED_A: DIE_LED_A.A RN8.8
DIE_LED_B1: DIE_LED_B1.A RN8.7
DIE_LED_B2: DIE_LED_B2.A RN10.6
DIE_LED_C1: DIE_LED_C1.A RN8.6
DIE_LED_C2: DIE_LED_C2.A RN10.7
DIE_LED_D1: DIE_LED_D1.A RN8.5
DIE_LED_D2: DIE_LED_D2.A RN10.8
DIE_R_A: RN8.1 U5.18(O0)
DIE_R_B1: RN8.2 U5.17(O1)
DIE_R_B2: RN10.3 U5.12(O6)
DIE_R_C1: RN8.3 U5.16(O2)
DIE_R_C2: RN10.2 U5.13(O5)
DIE_R_D1: RN8.4 U5.15(O3)
DIE_R_D2: RN10.1 U5.14(O4)

Not connected (* = marked no-connect by the designer): RN10 4* 5*; U5 11(O7)*

### Notes on the sheet
- (in symbol CM1293A-04SO) Vdd; Gnd

### Library data of the parts
C5 = Cap_CCNP_0603: as C4 on sheet DigitalLabBoard_Traffic; Published: 08/06/2000; Publisher: Altium Hobart Technology Centre; SubClass: Capacitor; Farnell PN: *; Digikey: *; Value: 100nF; LCSC: C14663
DIE_LED_A DIE_LED_B1 DIE_LED_B2 DIE_LED_C1 DIE_LED_C2 DIE_LED_D1 DIE_LED_D2 = LED-0603-Red: as D_REW on sheet DigitalLabBoard_Traffic; Published: 8-Jun-2000; Revision: July-2002: Re-released for DXP Platform.; Publisher: Altium Limited; Class II: LED; Farnell PN: 1581239; Digikey: *; LCSC: C2286
RN7 RN8 RN10 = ResistorNetwork_CR0603x4: SMT x4 Resistor Array; Farnell PN: *; Digikey: *
  RN7: Value: 10K; LCSC: C29718
  RN8 RN10: Value: 1K; LCSC: C20197
RN9 = ResistorNetwork_CR0603x4: SMT x4 Resistor Array; Value: 470 ohm; Farnell PN: *; Digikey: *; LCSC: C25510
U5 = 74HC541PW,118: as U3 on sheet DigitalLabBoard_LEDs; Digikey: 1727-5960-1-ND; Farnell PN: 2444902; LCSC: C5657
Z7 = CM1293A-04SO: as Z5 on sheet DigitalLabBoard_Traffic; Farnell PN: 2533258; Digikey: CM1293A-04SOOSCT-ND; LCSC: C393377
P5 = Header 2x4: Digikey: 609-5701-ND

## Sheet DigitalLabBoard_Stepper.SchDoc
size A4
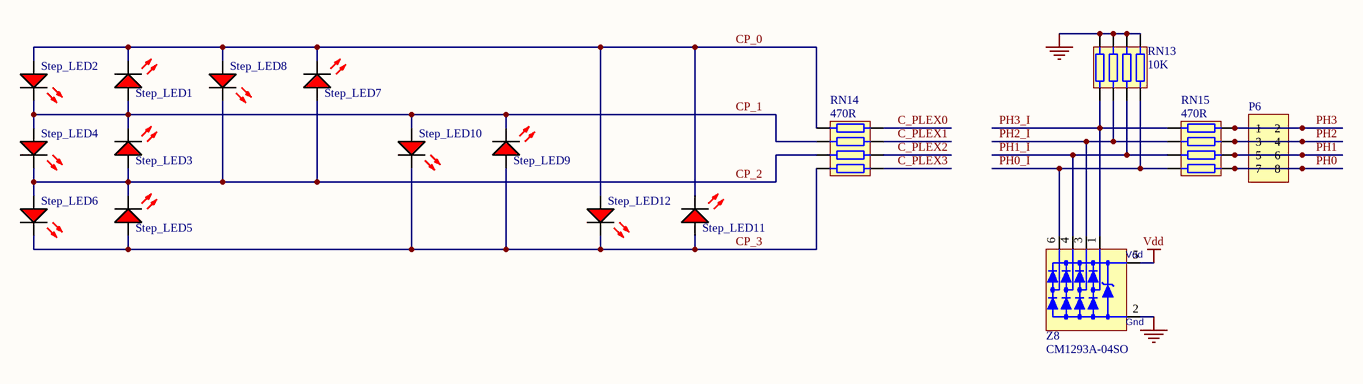
[diagram p5: DigitalLabBoard_Stepper.SchDoc]

### Parts
P6  Header 2x4  [HDR2X4S]  (value not drawn)
RN13  10K  [CR1206-0603_X4_N]
RN14  470R  [CR1206-0603_X4_N]
RN15  470R  [CR1206-0603_X4_N]
Step_LED1  LED Red  [LED1608-0603-RED]  (value not drawn)
Step_LED2  LED Red  [LED1608-0603-RED]  (value not drawn)
Step_LED3  LED Red  [LED1608-0603-RED]  (value not drawn)
Step_LED4  LED Red  [LED1608-0603-RED]  (value not drawn)
Step_LED5  LED Red  [LED1608-0603-RED]  (value not drawn)
Step_LED6  LED Red  [LED1608-0603-RED]  (value not drawn)
Step_LED7  LED Red  [LED1608-0603-RED]  (value not drawn)
Step_LED8  LED Red  [LED1608-0603-RED]  (value not drawn)
Step_LED9  LED Red  [LED1608-0603-RED]  (value not drawn)
Step_LED10  LED Red  [LED1608-0603-RED]  (value not drawn)
Step_LED11  LED Red  [LED1608-0603-RED]  (value not drawn)
Step_LED12  LED Red  [LED1608-0603-RED]  (value not drawn)
Z8  CM1293A-04SO  [SOT457_N]

### Nets
GND: RN13.1 RN13.2 RN13.3 RN13.4 Z8.2(Vn)
Vdd: Z8.5(Vp)  [project net Vcc]
C_PLEX0: RN14.4
C_PLEX1: RN14.3
C_PLEX2: RN14.2
C_PLEX3: RN14.1
CP_0: RN14.5 Step_LED1.K Step_LED2.A Step_LED7.K Step_LED8.A Step_LED11.K Step_LED12.A
CP_1: RN14.6 Step_LED1.A Step_LED2.K Step_LED3.K Step_LED4.A Step_LED9.K Step_LED10.A
CP_2: RN14.7 Step_LED3.A Step_LED4.K Step_LED5.K Step_LED6.A Step_LED7.A Step_LED8.K
CP_3: RN14.8 Step_LED5.A Step_LED6.K Step_LED9.A Step_LED10.K Step_LED11.A Step_LED12.K
PH0: P6.7 P6.8 RN15.8
PH0_I: RN13.8 RN15.1 Z8.6
PH1: P6.5 P6.6 RN15.7
PH1_I: RN13.7 RN15.2 Z8.4
PH2: P6.3 P6.4 RN15.6
PH2_I: RN13.6 RN15.3 Z8.3
PH3: P6.1 P6.2 RN15.5
PH3_I: RN13.5 RN15.4 Z8.1

### Notes on the sheet
- (in symbol CM1293A-04SO) Vdd; Gnd

### Library data of the parts
RN13 = ResistorNetwork_CR0603x4: SMT x4 Resistor Array; Farnell PN: *; Digikey: *; Value: 10K; LCSC: C29718
RN14 RN15 = ResistorNetwork_CR0603x4: SMT x4 Resistor Array; Value: 470 ohm; Farnell PN: *; Digikey: *; LCSC: C25510
Step_LED1-Step_LED12 = LED-0603-Red: as D_REW on sheet DigitalLabBoard_Traffic; Published: 8-Jun-2000; Revision: July-2002: Re-released for DXP Platform.; Publisher: Altium Limited; Class II: LED; Farnell PN: 1581239; Digikey: *; LCSC: C2286
Z8 = CM1293A-04SO: as Z5 on sheet DigitalLabBoard_Traffic; Farnell PN: 2533258; Digikey: CM1293A-04SOOSCT-ND; LCSC: C393377
P6 = Header 2x4: Digikey: 609-5701-ND

## Nets that join several sheets
GND: DigitalLabBoard_Traffic (26 pins), DigitalLabBoard_Processor (50 pins), DigitalLabBoard_Switches (23 pins), DigitalLabBoard_LEDs (22 pins), DigitalLabBoard_Die (16 pins), DigitalLabBoard_Stepper (5 pins)
Vcc: DigitalLabBoard_Traffic (9 pins), DigitalLabBoard_Processor (16 pins), DigitalLabBoard_Switches (12 pins), DigitalLabBoard_LEDs (C6.2 U3.20 Z3.5 Z4.5), DigitalLabBoard_Die (C5.2 U5.20 Z7.5), DigitalLabBoard_Stepper (Z8.5)
C_PLEX0: DigitalLabBoard_Processor (U1.33), DigitalLabBoard_Stepper (RN14.4)
C_PLEX1: DigitalLabBoard_Processor (U1.34), DigitalLabBoard_Stepper (RN14.3)
C_PLEX2: DigitalLabBoard_Processor (U1.35), DigitalLabBoard_Stepper (RN14.2)
C_PLEX3: DigitalLabBoard_Processor (U1.36), DigitalLabBoard_Stepper (RN14.1)
CAR_EW_BTN: DigitalLabBoard_Traffic (RN17.6 S_CEW.2b), DigitalLabBoard_Processor (RN19.6)
CAR_NS_BTN: DigitalLabBoard_Traffic (RN17.5 S_CNW.2b), DigitalLabBoard_Processor (RN19.5)
PED_EW_BTN: DigitalLabBoard_Traffic (RN17.8 S_PEW.1b), DigitalLabBoard_Processor (RN19.8)
PED_NS_BTN: DigitalLabBoard_Traffic (RN17.7 S_PNS.2), DigitalLabBoard_Processor (RN19.7)
PH0_I: DigitalLabBoard_Processor (U1.37), DigitalLabBoard_Stepper (RN13.8 RN15.1 Z8.6)
PH1_I: DigitalLabBoard_Processor (U1.38), DigitalLabBoard_Stepper (RN13.7 RN15.2 Z8.4)
PH2_I: DigitalLabBoard_Processor (U1.39), DigitalLabBoard_Stepper (RN13.6 RN15.3 Z8.3)
PH3_I: DigitalLabBoard_Processor (U1.40), DigitalLabBoard_Stepper (RN13.5 RN15.4 Z8.1)
SCL: DigitalLabBoard_Traffic (U4.22), DigitalLabBoard_Processor (OLED.3 R2.1 TP_SCL.1 U1.27), DigitalLabBoard_Switches (U2.22)
SDA: DigitalLabBoard_Traffic (U4.23), DigitalLabBoard_Processor (OLED.4 R1.1 TP_SDA.1 U1.28), DigitalLabBoard_Switches (U2.23)